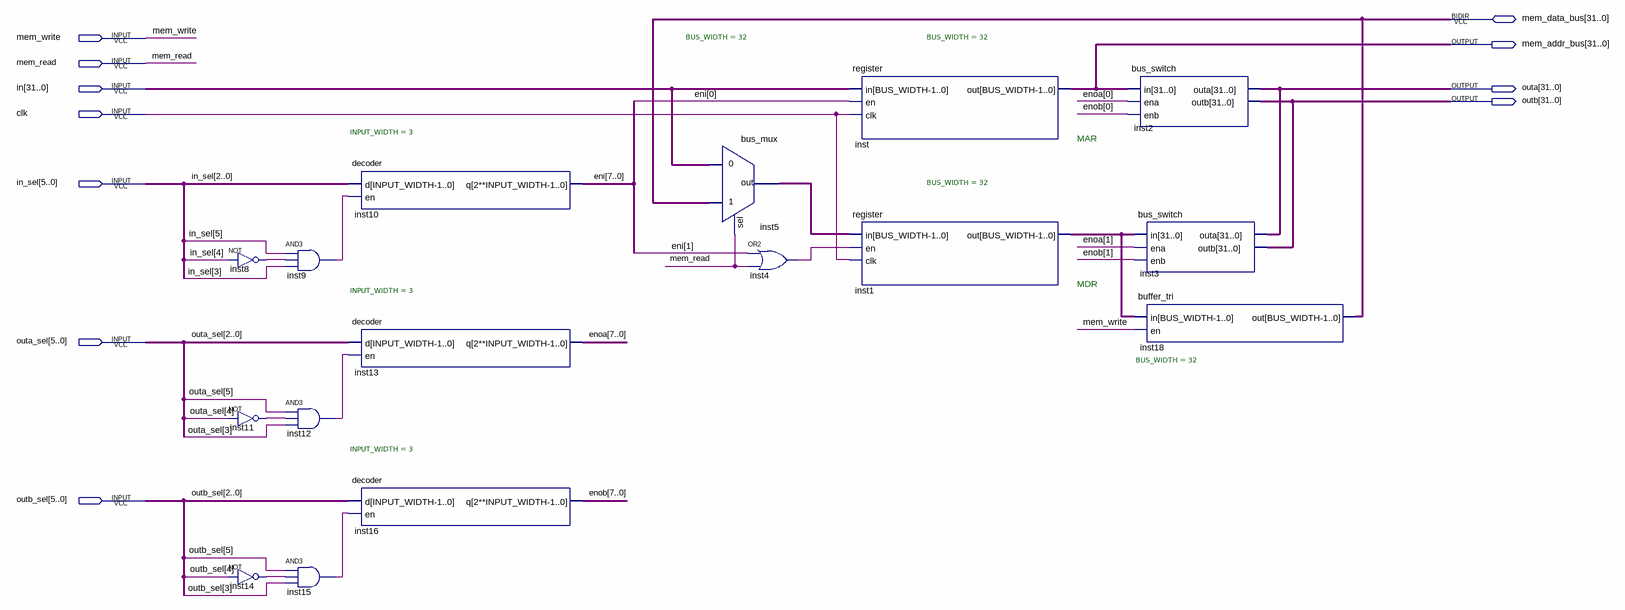
[diagram p0: schematic sheet]
// Quartus schematic memory_register_bank.bdf as structural Verilog: 16 symbols, 11 pins
module memory_register_bank (
  input  mem_write,
  input  mem_read,
  input  [31:0] in,
  input  clk,
  input  [5:0] in_sel,
  input  [5:0] outa_sel,
  input  [5:0] outb_sel,
  inout  [31:0] mem_data_bus,
  output [31:0] mem_addr_bus,
  output [31:0] outa,
  output [31:0] outb
);

  wire inst4_out, inst8_out, inst9_out, inst11_out, inst12_out, inst14_out, inst15_out;
  wire [7:0] eni, enoa, enob;
  wire [31:0] inst1_out, inst5_out;

  not inst8 (inst8_out, in_sel[4]);
  not inst11 (inst11_out, outa_sel[4]);
  not inst14 (inst14_out, outb_sel[4]);
  and inst9 (inst9_out, in_sel[5], inst8_out, in_sel[3]);
  and inst12 (inst12_out, outa_sel[5], inst11_out, outa_sel[3]);
  and inst15 (inst15_out, outb_sel[5], inst14_out, outb_sel[3]);
  decoder #(.INPUT_WIDTH(3)) inst10 (.d(in_sel[2:0]), .en(inst9_out), .q(eni));
  decoder #(.INPUT_WIDTH(3)) inst13 (.d(outa_sel[2:0]), .en(inst12_out), .q(enoa));
  decoder #(.INPUT_WIDTH(3)) inst16 (.d(outb_sel[2:0]), .en(inst15_out), .q(enob));
  bus_mux #(.BUS_WIDTH(32)) inst5 (.in0(in), .in1(mem_data_bus), .sel(mem_read), .out(inst5_out));
  or inst4 (inst4_out, eni[1], mem_read);
  register #(.BUS_WIDTH(32)) inst (.in(in), .en(eni[0]), .clk(clk), .out(mem_addr_bus));
  register #(.BUS_WIDTH(32)) inst1 (.in(inst5_out), .en(inst4_out), .clk(clk), .out(inst1_out));
  bus_switch inst2 (.in(mem_addr_bus), .ena(enoa[0]), .enb(enob[0]), .outa(outa), .outb(outb));
  bus_switch inst3 (.in(inst1_out), .ena(enoa[1]), .enb(enob[1]), .outa(outa), .outb(outb));
  buffer_tri #(.BUS_WIDTH(32)) inst18 (.in(inst1_out), .en(mem_write), .out(mem_data_bus));

  // Notes on the sheet:
  //   MAR
  //   MDR
endmodule
